# EAGLE design accelerometer_soft_spi (EAGLE 9.6.2)
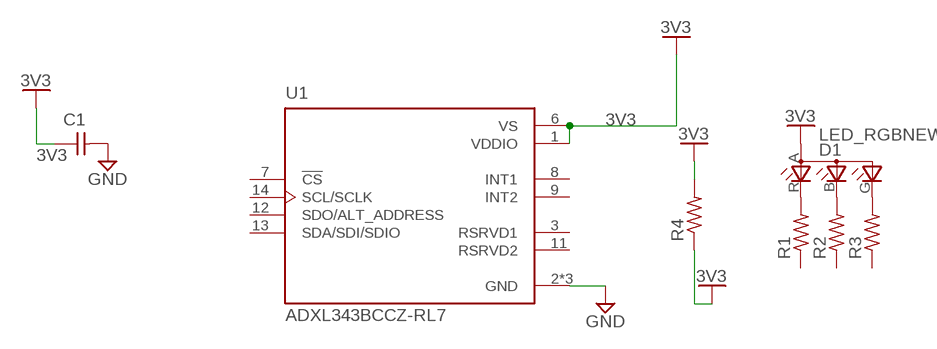
[diagram p0: schematic, sheet 1]

## Parts
C1  CAP_UNPOLARIZED  [C1206]
D1  LED_RGBNEW  [P-LCC-4]
R1  R1206  [R1206]
R2  R1206  [R1206]
R3  R1206  [R1206]
R4  R1206  [R1206]
U1  ADXL343BCCZ-RL7  [PQFN80P300X500X100-14N]

## Nets
3V3: C1.1 D1.A(A2) R4.1 R4.2 U1.1(VDDIO) U1.6(VS)
GND: C1.2 U1.2(GND) U1.4(GND) U1.5(GND)
N$1: D1.R(CRED) R1.2
N$2: D1.B(CBLUE) R2.2
N$3: D1.G(CGREEN) R3.2
Unconnected: R1.1 R2.1 R3.1 U1.3(RSRVD1) U1.7(!CS) U1.8(INT1) U1.9(INT2) U1.11(RSRVD2) U1.12(SDO/ALT_ADDRESS) U1.13(SDA/SDI/SDIO) U1.14(SCL/SCLK)

## Library data of the parts
C1 = rhart:CAP_UNPOLARIZED
D1 = fab:LED_RGBNEW
R1-R4 = fab:R: Resistor (US Symbol) Variants with postfix FAB are widened to allow the routing of internal traces
U1 = rhart:ADXL343BCCZ-RL7: Accelerometer Triple ±2/±4/±8/±16g 2V to 3.6V 14-Pin LGA T/R Check availability <https://pricing.snapeda.com/parts/ADXL343BCCZ-RL7/Analog%20Devices/view-part?ref=eda>; AVAILABILITY: In Stock; DESCRIPTION: 3-Axis, ±2 g/±4 g/±8 g/±16 g Digital Accelerometer; MF: Analog Devices; MP: ADXL343BCCZ-RL7; PACKAGE: LGA -14 Analog Devices; PRICE: None; PURCHASE-URL: https://pricing.snapeda.com/search/part/ADXL343BCCZ-RL7/?ref=eda

## Board
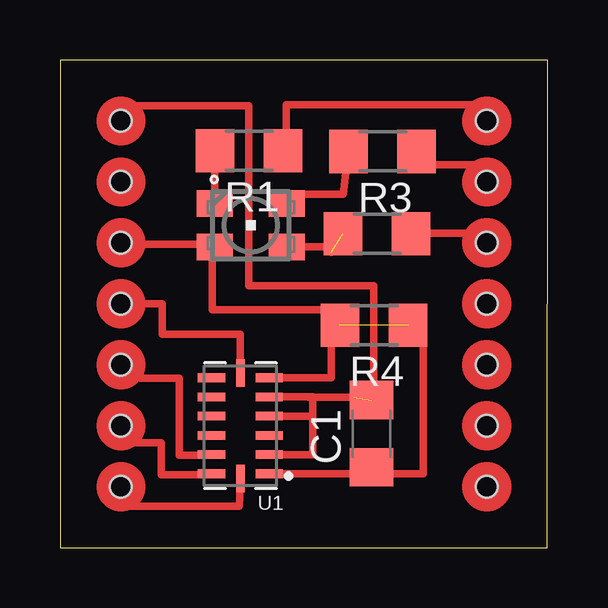
[diagram p1: board, top side]
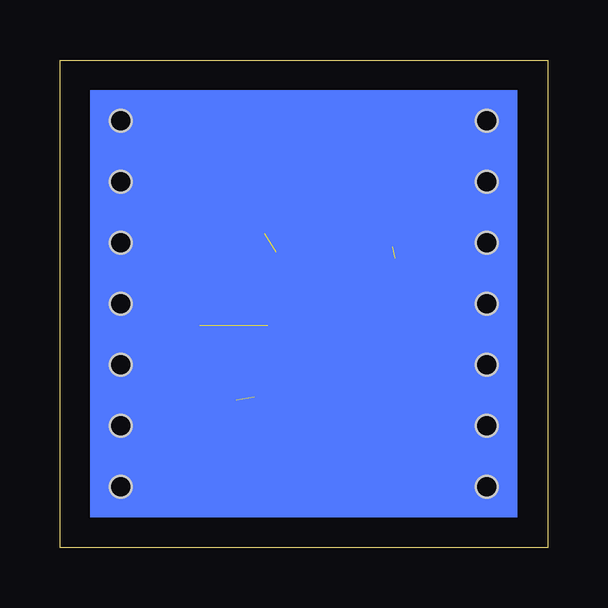
[diagram p2: board, bottom side, seen from below]

Size 20.32 x 20.32 mm. Coordinates in mm from the lower left corner, seen from the top.
Outline: 0,0 20.3,0 20.32,20.32 0,20.32 0,0
Copper layers (1*16): Top 0.035mm / dielectric 1.5mm / Bottom 0.035mm
Design rules "default": minimum track width 6mil, minimum drill 0.35mm, track to track 6mil, track to pad 6mil, pad to pad 6mil, via to via 6mil, smd to smd 6mil, copper to edge 40mil, drill to drill 6mil, minimum pad ring 10mil, minimum via ring 8mil, stop-mask expansion 4mil, vias tented up to drill 0mil, thermal gap 10mil
Holes 0.9 mm at 2.54,17.78 2.54,15.24 2.54,12.7 2.54,10.16 2.54,7.62 2.54,5.08 2.54,2.54 17.78,17.78 17.78,15.24 17.78,12.7 17.78,10.16 17.78,7.62 17.78,5.08 17.78,2.54

### Footprints (pad centres in the part's own frame; a part is rotated, then mirrored left to right if it is on the bottom)
C1206 = smd 1.6 x 1.8: 1 -1.4,0; 2 1.4,0
P-LCC-4 = smd 1.1 x 1.5: A 0.902,-1.5; B 0.902,1.5; G -0.902,1.5; R -0.902,-1.5
R1206 = smd 1.6 x 1.803: 1 -1.422,0; 2 1.422,0
PQFN80P300X500X100-14N = smd 1.143 x 0.356: 1 -1.2,2; 2 -1.2,1.2; 3 -1.2,0.4; 4 -1.2,-0.4; 5 -1.2,-1.2; 6 -1.2,-2; 8 1.2,-2; 9 1.2,-1.2; 10 1.2,-0.4; 11 1.2,0.4; 12 1.2,1.2; 13 1.2,2 | smd 0.356 x 1.143: 7 0,-2.2; 14 0,2.2

### Placement (x,y rotation side)
C1  12.98,4.75 90 top
D1  7.95,13.44 270 top
R1  7.87,16.54 180 top
R2  13.21,13.08 180 top
R3  13.44,16.51 180 top
R4  13.08,9.27 180 top
U1  7.52,5.08 180 top

### Tracks (layer width: path | path; a pad name or v marks a point on that pad's centre or on a via)
3V3  (2 unrouted)
  Top 0.305: U1.6 11.3,7.08 11.3,9.27 | 11.3,9.27 11.3,9.91 6.35,9.91 6.35,12.06 | U1.1 12.98,3.08 | 12.98,3.08 C1.1 | R4.2 11.3,9.27 | R4.1 15.14,8.64 15.14,3.08 12.98,3.08
GND  (1 unrouted)
  Top 0.305: U1.5 10.34,6.28 | 10.34,6.28 10.54,6.28 10.54,5.48 | 10.34,6.28 10.34,6.27 12.22,6.27 | U1.4 10.54,5.48 | U1.2 10.54,3.88 10.54,5.48
N$1
  Top 0.305: R1.2 D1.R
N$2  (1 unrouted)
  Top 0.305: D1.B 11.3,12.54 11.3,12.32
N$3
  Top 0.305: D1.G 9.45,14.73 11.81,14.73 R3.2
N$4
  Top 0.305: 7.52,2.49 7.47,1.73 4.32,1.73 4.27,1.73 2.64,1.73
N$5
  Top 0.305: 5.89,3.05 4.22,3.05 4.22,4.37 2.95,4.37
N$6
  Top 0.305: 5.89,3.86 4.98,3.86 4.98,7.06 3.35,7.06 3.35,7.52
N$7
  Top 0.305: 7.52,7.75 7.52,8.81
N$8
  Top 0.305: 3.2,18.41 7.87,18.41 7.87,10.92 13.08,10.92 13.08,6.35
N$9
  Top 0.305: 14.78,13.11 17.12,13.11
N$10
  Top 0.305: 14.88,15.95 17.73,15.95 17.73,16
N$11
  Top 0.305: 9.42,17.02 9.42,18.47 17.83,18.47
N$12
  Top 0.305: 7.52,8.89 4.27,8.89 4.27,10.16 3.3,10.16
N$13
  Top 0.305: 3.3,12.65 6.3,12.65
(copper drawn outside any net)
  shapes: Bottom area x1, Top circle x15